# Altium schematic sheet spi_adc.SchDoc
size 447 x 332 mm
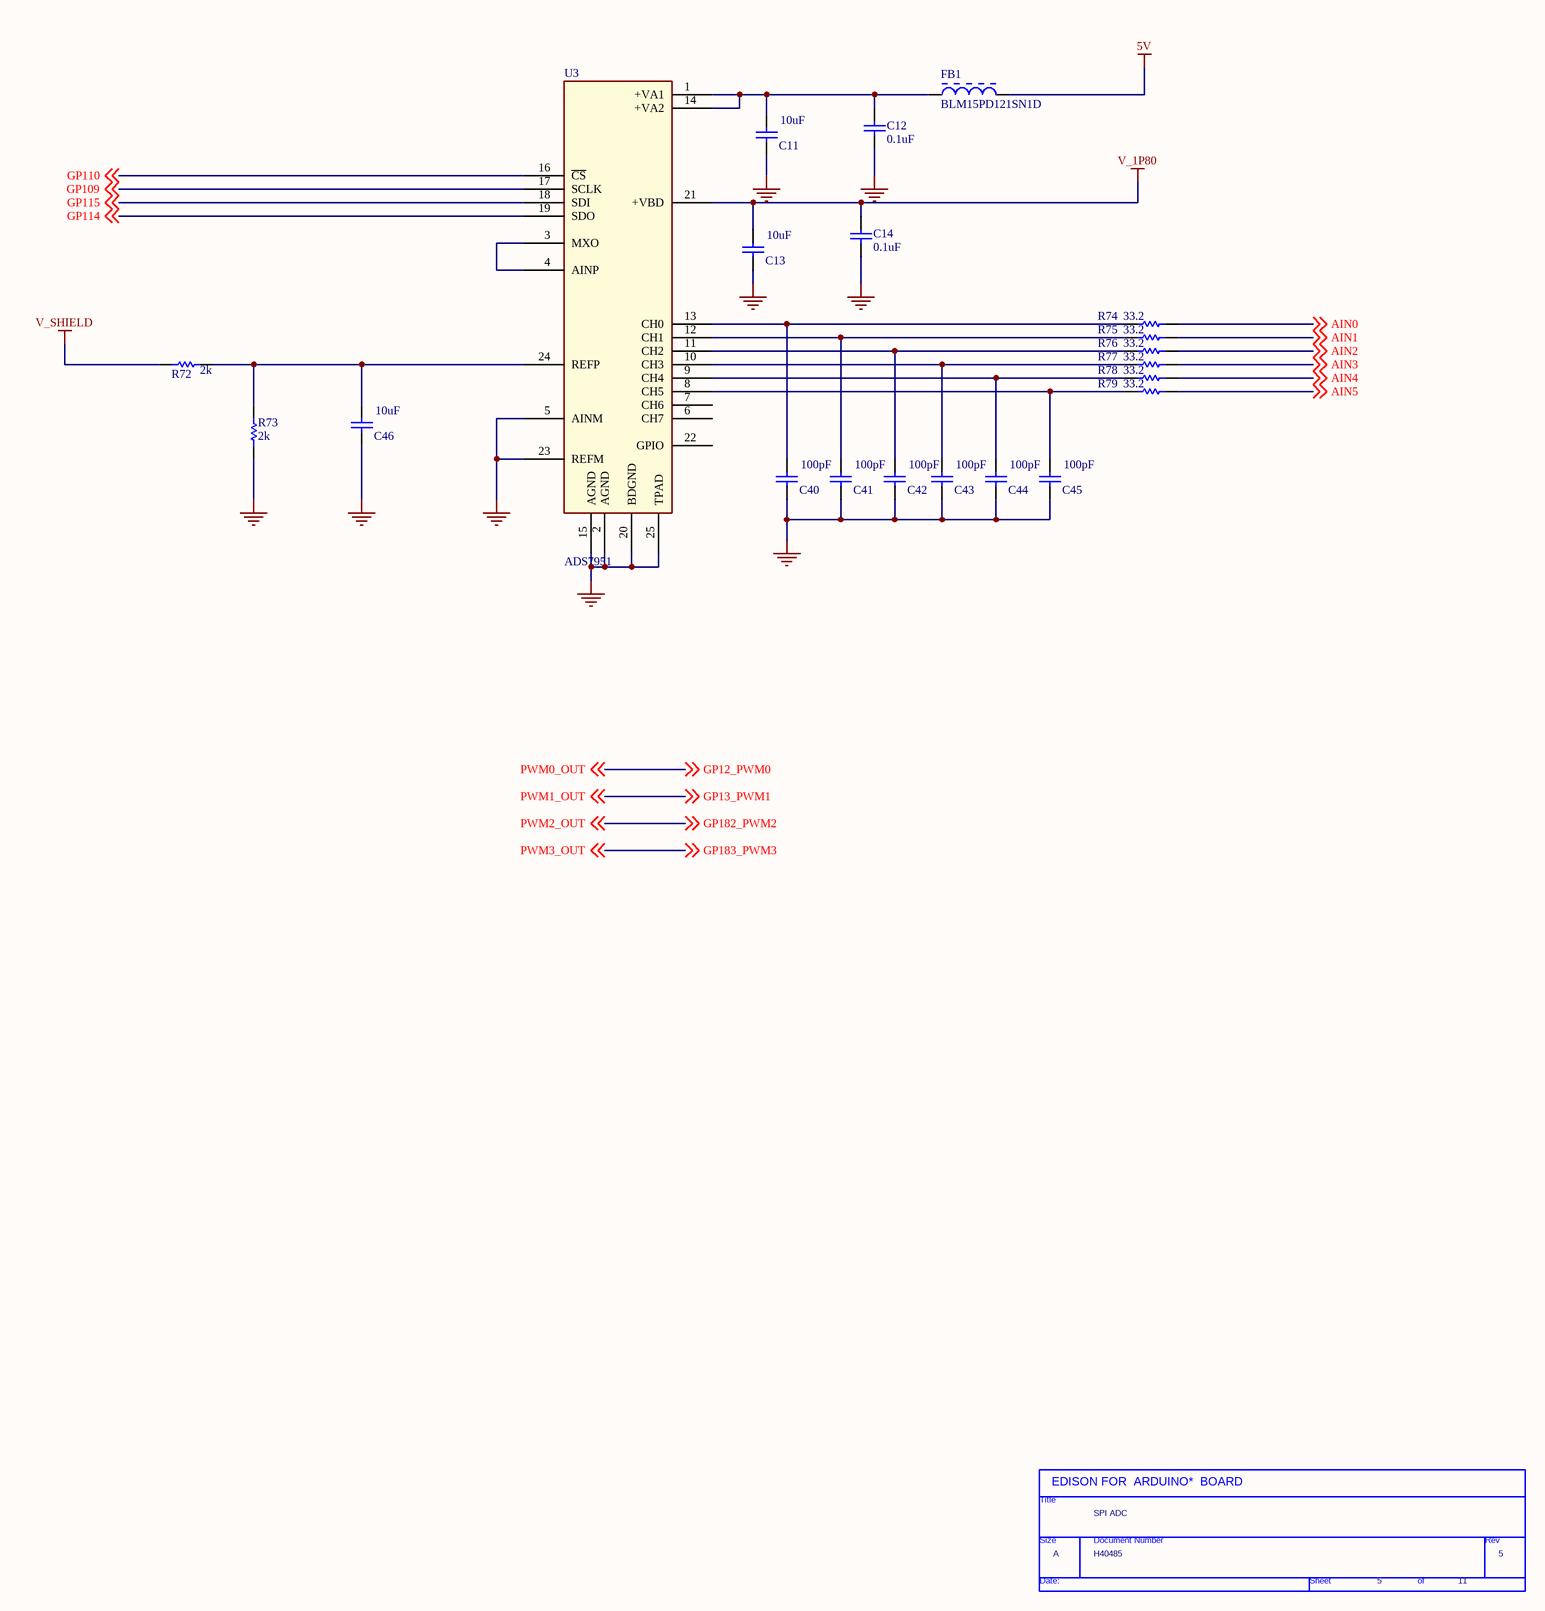
[diagram p0: spi_adc.SchDoc]

## Parts
*  Page Count: 11  Page Number: 5  Page Size: A  Title: SPI ADC  Doc: H40485  (hidden comment: TitleBlock0)  (graphical)
C11  value 10uF  [CAPC0402(1005)60_N]  (hidden comment: CAP 10uF 6.3V 0402(1005))
C12  value 0.1uF  [CAPC0201(0603)33_L]  (hidden comment: CAP 1.5nF 10V 0201(0603))
C13  value 10uF  [CAPC0402(1005)60_N]  (hidden comment: CAP 10uF 6.3V 0402(1005))
C14  value 0.1uF  [CAPC0201(0603)33_L]  (hidden comment: CAP 1.5nF 10V 0201(0603))
C40  value 100pF  [CAPC0201(0603)33_N]  (hidden comment: CAP 100pF 25V 0201(0603))
C41  value 100pF  [CAPC0201(0603)33_N]  (hidden comment: CAP 100pF 25V 0201(0603))
C42  value 100pF  [CAPC0201(0603)33_N]  (hidden comment: CAP 100pF 25V 0201(0603))
C43  value 100pF  [CAPC0201(0603)33_N]  (hidden comment: CAP 100pF 25V 0201(0603))
C44  value 100pF  [CAPC0201(0603)33_N]  (hidden comment: CAP 100pF 25V 0201(0603))
C45  value 100pF  [CAPC0201(0603)33_N]  (hidden comment: CAP 100pF 25V 0201(0603))
C46  value 10uF  [CAPC0402(1005)60_N]  (hidden comment: CAP 10uF 6.3V 0402(1005))
FB1  BLM15PD121SN1D  [MURA-BLM15-CHIP-2_V]
R72  value 2k  [RESC0201(0603)_M]  (hidden comment: 2K 5% 0201(0603))
R73  value 2k  [RESC0201(0603)_M]  (hidden comment: 2K 5% 0201(0603))
R74  value 33.2  [RESC0201(0603)_N]  (hidden comment: 33R2 1% 0201(0603))
R75  value 33.2  [RESC0201(0603)_N]  (hidden comment: 33R2 1% 0201(0603))
R76  value 33.2  [RESC0201(0603)_N]  (hidden comment: 33R2 1% 0201(0603))
R77  value 33.2  [RESC0201(0603)_N]  (hidden comment: 33R2 1% 0201(0603))
R78  value 33.2  [RESC0201(0603)_N]  (hidden comment: 33R2 1% 0201(0603))
R79  value 33.2  [RESC0201(0603)_N]  (hidden comment: 33R2 1% 0201(0603))
U3  ADS7951  [S-PVQFN-N24]

## Nets
5V: FB1.2
GND: C11.1 C12.2 C13.1 C14.2 C40.2 C41.2 C42.2 C43.2 C44.2 C45.2 C46.1 R73.1 U3.2(AGND) U3.5(AINM) U3.15(AGND) U3.20(BDGND) U3.23(REFM) U3.25(TPAD)
V_1P80: C13.2 C14.1 U3.21(+VBD)
V_SHIELD: R72.1
AIN0: R74.2 ; off-sheet AIN0
AIN1: R75.2 ; off-sheet AIN1
AIN2: R76.2 ; off-sheet AIN2
AIN3: R77.2 ; off-sheet AIN3
AIN4: R78.2 ; off-sheet AIN4
AIN5: R79.2 ; off-sheet AIN5
GP12_PWM0: off-sheet GP12_PWM0, off-sheet PWM0_OUT  [also labelled PWM0_OUT]
GP13_PWM1: off-sheet GP13_PWM1, off-sheet PWM1_OUT  [also labelled PWM1_OUT]
GP109: U3.17(SCLK) ; off-sheet GP109
GP110: U3.16(~{CS}) ; off-sheet GP110
GP114: U3.19(SDO) ; off-sheet GP114
GP115: U3.18(SDI) ; off-sheet GP115
GP182_PWM2: off-sheet GP182_PWM2, off-sheet PWM2_OUT  [also labelled PWM2_OUT]
GP183_PWM3: off-sheet GP183_PWM3, off-sheet PWM3_OUT  [also labelled PWM3_OUT]
NetC11_2: C11.2 C12.1 FB1.1 U3.1(+VA1) U3.14(+VA2)
NetC40_1: C40.1 R74.1 U3.13(CH0)
NetC41_1: C41.1 R75.1 U3.12(CH1)
NetC42_1: C42.1 R76.1 U3.11(CH2)
NetC43_1: C43.1 R77.1 U3.10(CH3)
NetC44_1: C44.1 R78.1 U3.9(CH4)
NetC45_1: C45.1 R79.1 U3.8(CH5)
NetC46_2: C46.2 R72.2 R73.2 U3.24(REFP)
NetU3_3: U3.3(MXO) U3.4(AINP)

Not connected (* = marked no-connect by the designer): U3 6(CH7) 7(CH6) 22(GPIO)

## Notes on the sheet
- (in symbol TitleBlock0) EDISON FOR  ARDUINO*  BOARD; Title; Size; Document Number; Rev; Date:; Sheet; of

## Library data of the parts
C11 C13 C46 = CMP-1034-02138-1: CAP 10uF 6.3V ±20% 0402 (1005 Metric) Thickness 0.6mm SMD; Case-Metric: 1005; Case-EIA: 0402; Tolerance: ±20%; Rated Voltage: 6.3 V; Technology: SMT; Max Thickness: 0.6 mm; Supplier 1: Digi-Key; Supplier Part Number 1: 1276-1451-1-ND
C12 C14 = CMP-1033-00601-1: CAP 1.5nF 10V ±20% 0201 (0603 Metric) Thickness 0.33mm SMD; Case-Metric: 0603; Case-EIA: 0201; Rated Voltage: 10 V; Technology: SMT; Tolerance: ±20%; Max Thickness: 0.33 mm; Supplier 1: Digi-Key; Supplier Part Number 1: 1276-1115-1-ND
C40-C45 = CMP-1033-00493-1: CAP 100pF 25V ±5% 0201 (0603 Metric) Thickness 0.33mm SMD; Case-EIA: 0201; Case-Metric: 0603; Tolerance: ±5%; Rated Voltage: 25 V; Max Thickness: 0.33 mm; Technology: SMT; Supplier 1: Digi-Key; Supplier Part Number 1: 1276-1385-1-ND
FB1 = CMP-0686-00281-1: Chip Ferrite Bead for Power Lines, 120 Ohm, 1300 mA, -55 to 125 degC, 1 x 0.5 x 0.55 mm SMD, Tape and Reel; Manufacturer: Murata; DC Resistance: 0.09 Ohm Max.; Rated Current: 1300 mA; Impedance (at 100 MHz): 120 Ohm +/- 25%; DatasheetVersion: 08/2013; PackageReference: BLM15-2; ComponentLink1Description: Manufacturer URL; ComponentLink1URL: http://www.murata.com/; ComponentLink3Description: Package Specification; Mounting Technology: Surface Mount; Operating Temperature Range: -55 to 125 degC; ComponentLink2Description: Datasheet; Packing: Tape and Reel; PackageDescription: 2-Pin Chip, Body 1 x 0.5 mm, Pitch 0.9 mm; ComponentLink3URL: http://www.murata.com/products/catalog/pdf/c31e.pdf; ComponentLink2URL: http://www.murata.com/products/catalog/pdf/c31e.pdf; PartNumber: BLM15PD121SN1D; Supplier 1: Digi-Key; Supplier Part Number 1: 490-5203-1-ND
R72 R73 = CMP-1010-00081-1: 2K 0.05W 5% 0201 (0603 Metric)  SMD; Tolerance: 1 %; Case-EIA: 0201; Case-Metric: 0603; Power: 0.05 W; Technology: SMT; Supplier 1: Digi-Key; Supplier Part Number 1: 541-2.00KABCT-ND
R74-R79 = CMP-1010-00248-1: 33R2 0.05W 1% 0201 (0603 Metric)  SMD; Case-Metric: 0603; Case-EIA: 0201; Power: 0.05 W; Tolerance: 1 %; Technology: SMT; Supplier 1: Mouser; Supplier Part Number 1: 660-RK73H1HTTC33R2F
* = TitleBlock0: RevCode: 5; Page Create Date: March  8, 1995
U3 = ADS7951: Supplier 1: Digi-Key; Supplier Part Number 1: 296-25840-1-ND